# EAGLE design adaptor (EAGLE 8.0.1)
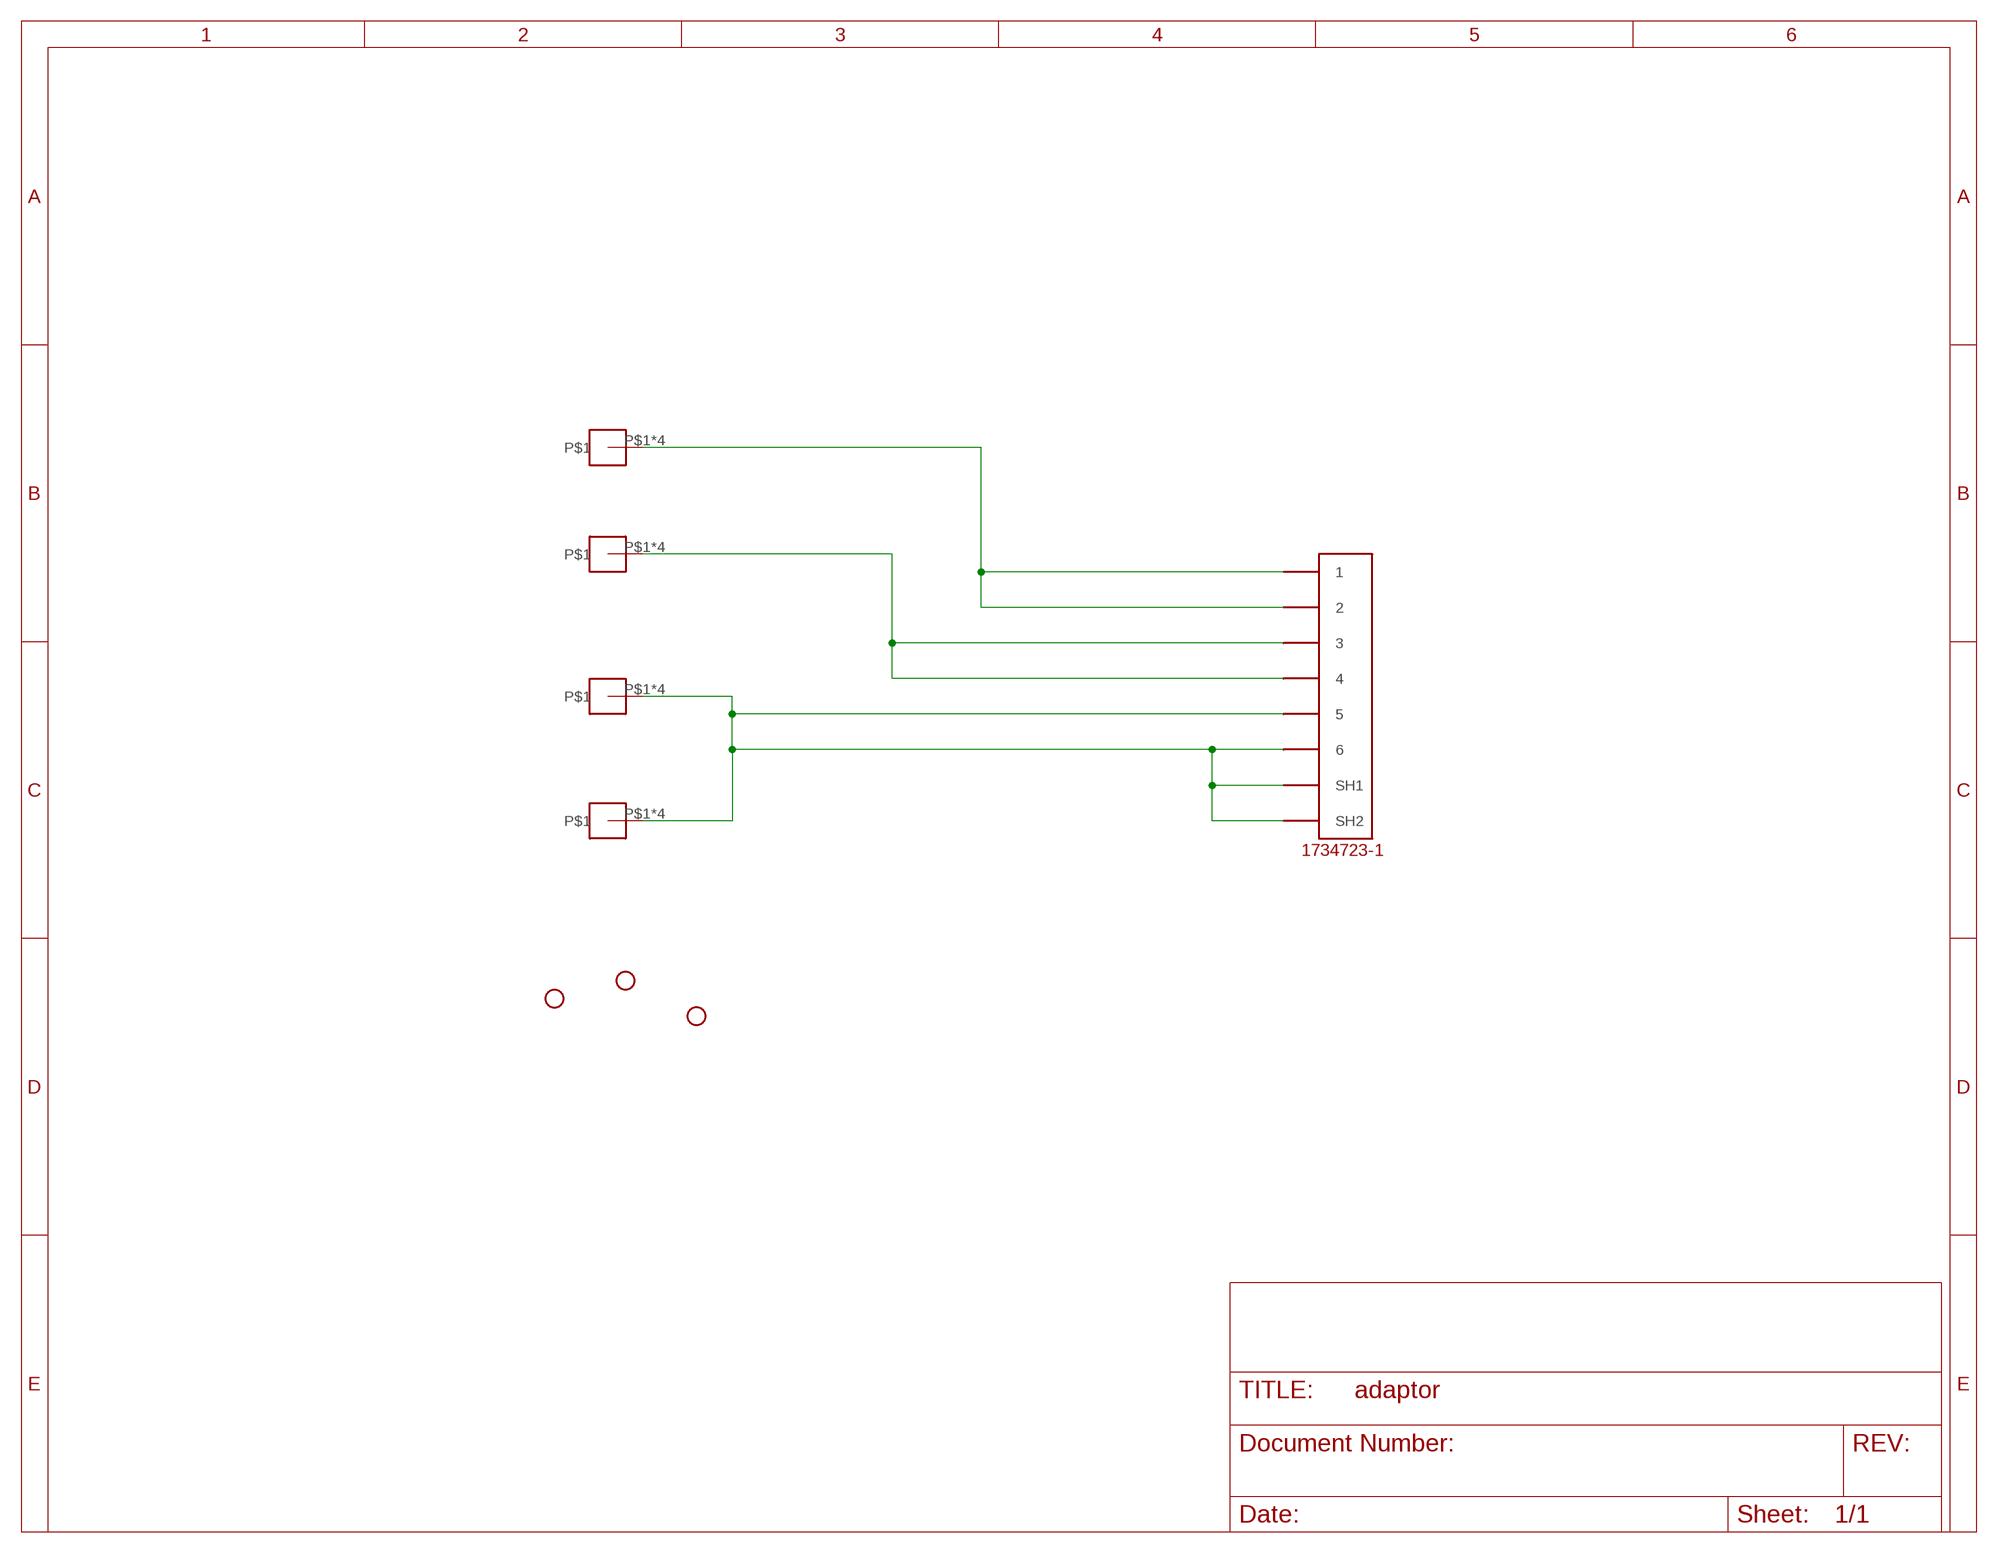
[diagram p0: schematic, sheet 1]

## Parts
H1  STAND-OFF  [STAND-OFF]
H2  STAND-OFF  [STAND-OFF]
H3  STAND-OFF  [STAND-OFF]
U$1  SCREW-8191  [SCREW-8191]
U$2  SCREW-8191  [SCREW-8191]
U$3  5555140-6  [1734723-1_RJ11]
U$4  SCREW-8191  [SCREW-8191]
U$6  SCREW-8191  [SCREW-8191]

## Nets
5V: U$1.P$1 U$1.P$2 U$1.P$3 U$1.P$4 U$3.3 U$3.4
12V: U$3.1 U$3.2 U$6.P$1 U$6.P$2 U$6.P$3 U$6.P$4
GND: U$2.P$1 U$2.P$2 U$2.P$3 U$2.P$4 U$3.5 U$3.6 U$3.SH1 U$3.SH2 U$4.P$1 U$4.P$2 U$4.P$3 U$4.P$4

## Library data of the parts
H1-H3 = SparkFun-Electromechanical:STAND-OFF: #4 Stand Off This is the mechanical footprint for a #4 phillips button head screw. Use the keepout ring to avoid running the screw head into surrounding components. SKU : PRT-00447
U$1 U$2 U$4 U$6 = Shell2013:SCREW-8191
U$3 = 5555140-6 RJ11:5555140-6

## Board
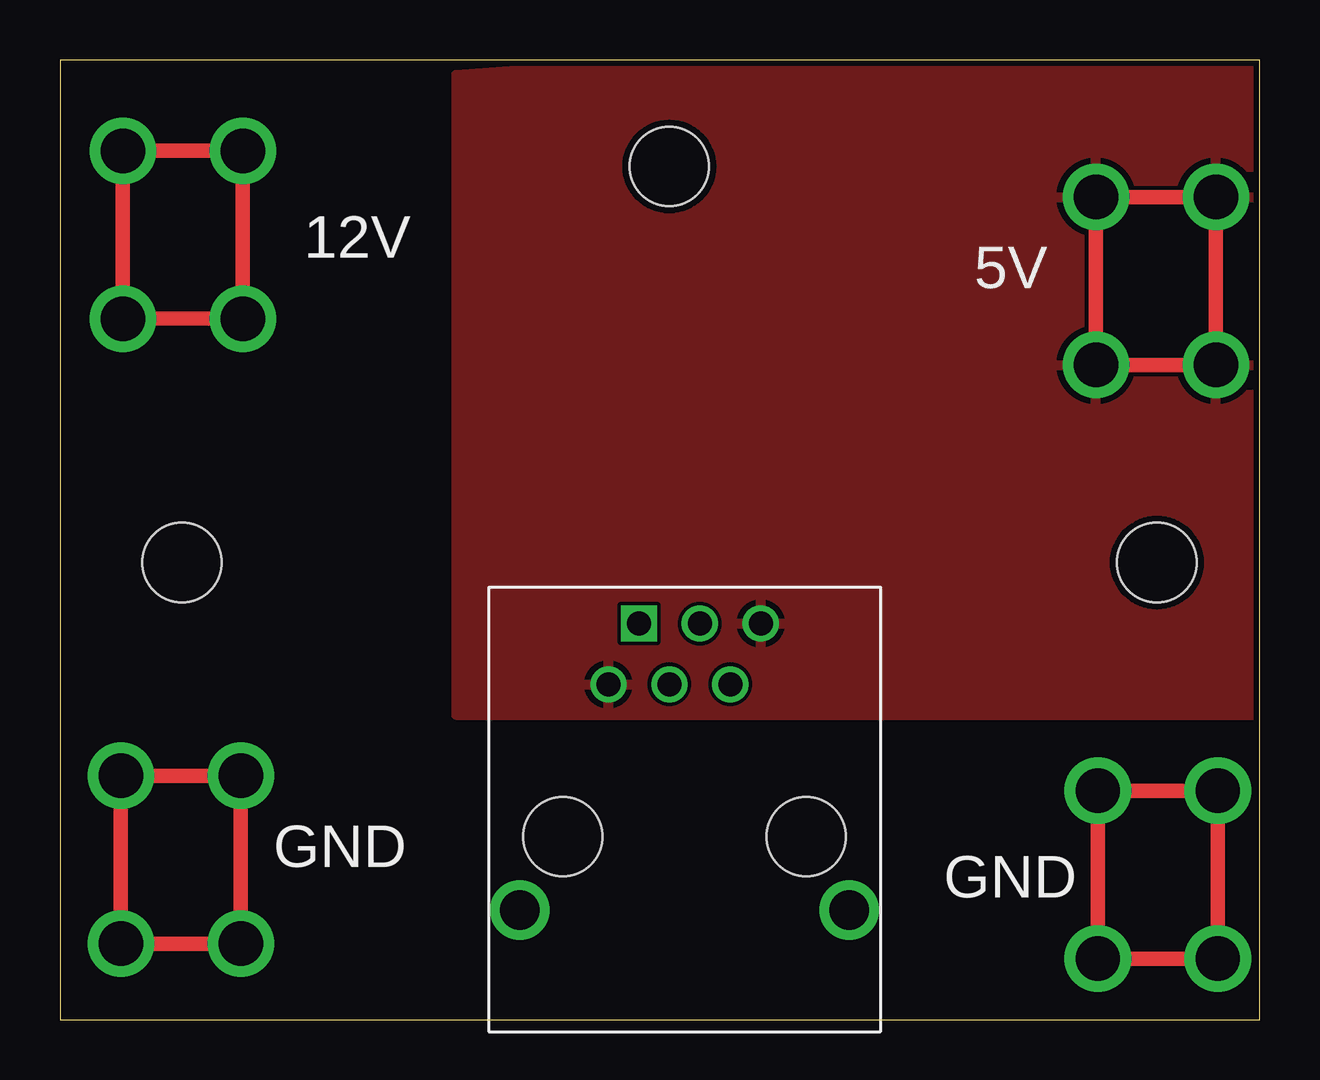
[diagram p1: board, top side]
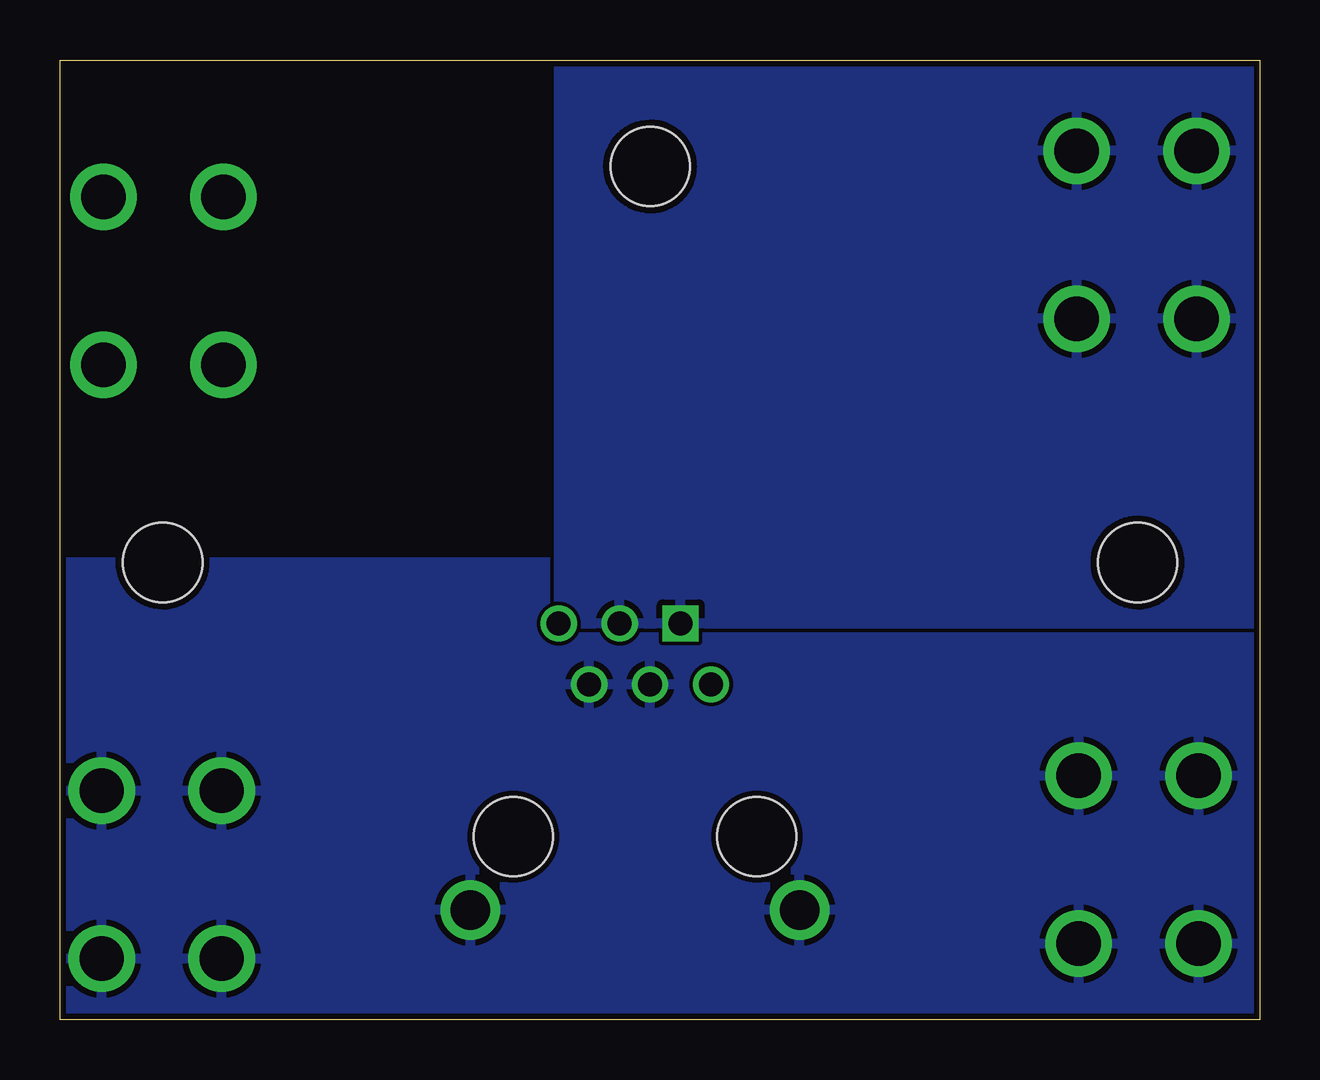
[diagram p2: board, bottom side, seen from below]

Size 50 x 40 mm. Coordinates in mm from the lower left corner, seen from the top.
Outline: 0,0 50,0 50,40 0,40 0,0
Copper layers (1*16): Top 0.035mm / dielectric 1.5mm / Bottom 0.035mm
Design rules "SeeedStudio_2layer_DRU_no_angle_20140221": minimum track width 6mil, minimum drill 12mil, track to track 6mil, track to pad 6mil, pad to pad 6mil, via to via 6mil, smd to smd 0mil, copper to edge 10mil, drill to drill 10mil, minimum pad ring 10mil, minimum via ring 6mil, stop-mask expansion 2mil, vias tented up to drill 100mil, thermal gap 10mil

### Footprints (pad centres in the part's own frame; a part is rotated, then mirrored left to right if it is on the bottom)
STAND-OFF = hole 3.302: 0,0
SCREW-8191 = drill 1.85: P$1 0,0; P$2 0,5; P$3 7,5; P$4 7,0
1734723-1_RJ11 = drill 1 square: 1 -2.54,2.54 | drill 1: 2 0,2.54; 3 2.54,2.54; 4 -3.81,0; 5 -1.27,0; 6 1.27,0 | drill 1.65: SH1 -7.5,-9.4; SH2 6.22,-9.4 | hole 3.3: -5.72,-6.35; 4.44,-6.35

### Placement (x,y rotation side)
H1  25.4,35.56 0 top
H2  5.08,19.05 0 top
H3  45.72,19.05 0 top
U$1  43.18,34.29 270 top
U$2  2.54,10.16 270 top
U$3  26.67,13.97 0 top
U$4  48.26,2.54 90 top
U$6  7.62,29.21 90 top

### Tracks (layer width: path | path; a pad name or v marks a point on that pad's centre or on a via)
5V
  pour Top: 16.51,12.7 50.8,12.7 50.8,41.91 16.51,39.37
12V
  pour Bottom: -3.81,40.64 29.21,40.64 29.21,16.51 -3.81,16.51
GND
  pour Bottom (rank 5): -2.54,19.05 53.34,19.05 53.34,-1.27 -2.54,-1.27

### Text on the board
tPlace: 12V | 5V | GND | GND